# Altium schematic sheet GDRIVE4.SchDoc
size A3
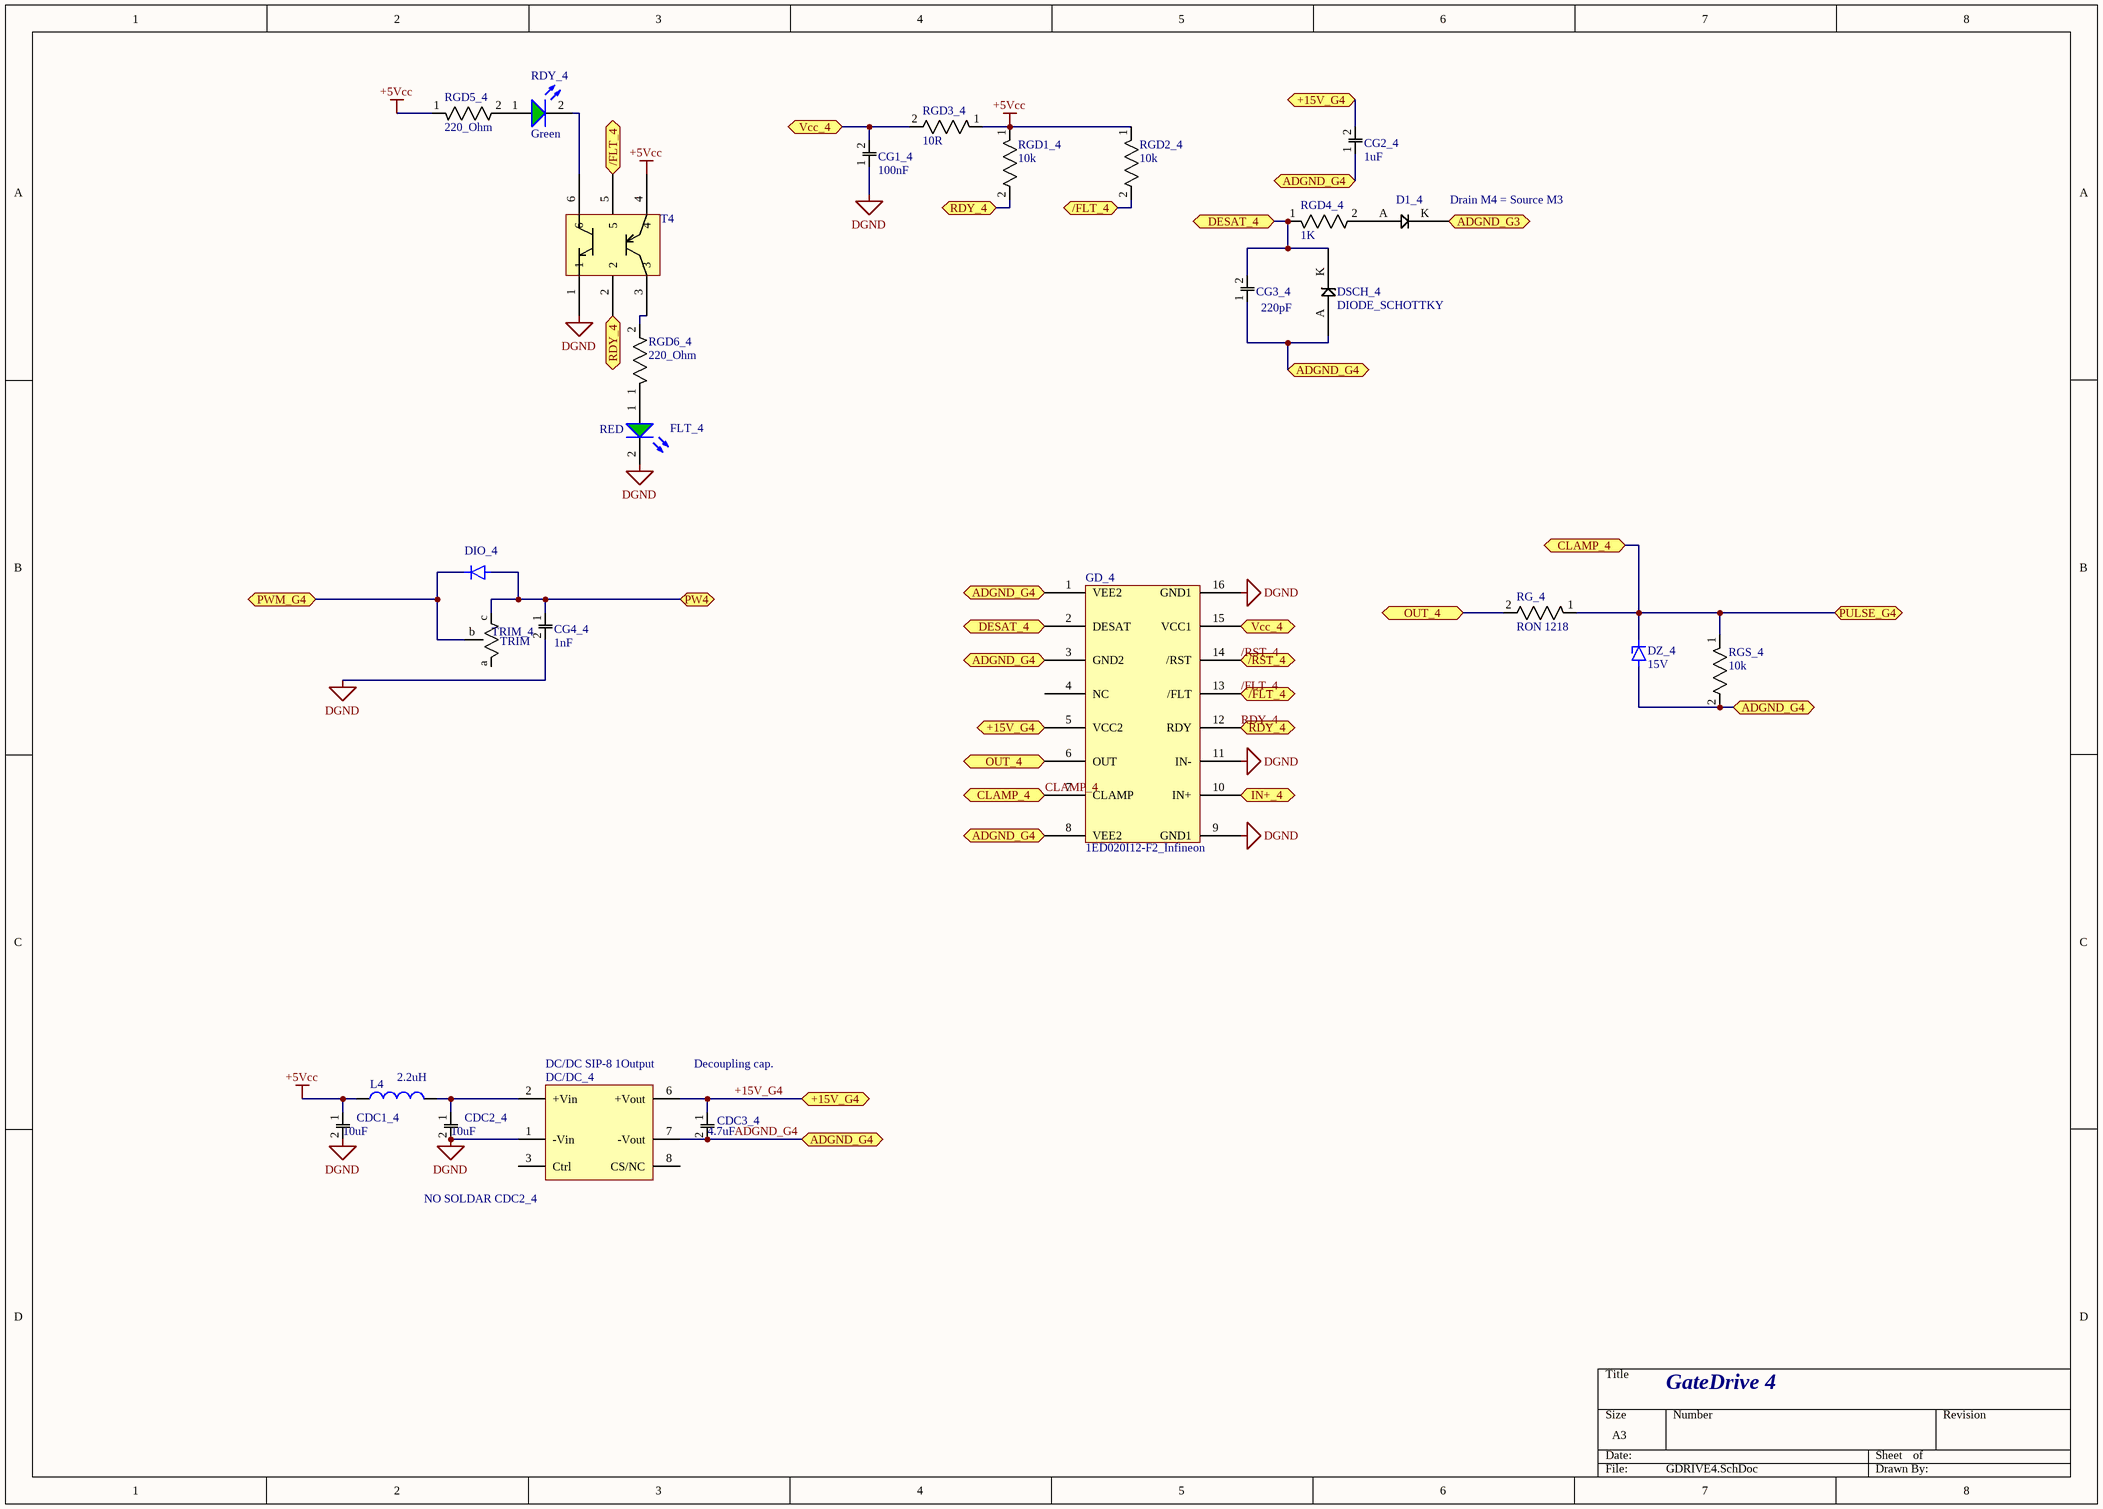
[diagram p0: GDRIVE4.SchDoc]

## Parts
CDC1_4  10uF  [C1206]
CDC2_4  10uF  [C1206]
CDC3_4  4.7uF  [C1206]
CG1_4  100nF  [CAP_0805_L]
CG2_4  1uF  [CAP_0603]
CG3_4  220pF  [CAP_0603]
CG4_4  1nF  [CAP_0805]
D1_4  DIODE  [DO-214AC]  (value not drawn)
DC/DC_4  DC/DC SIP-8 1Output  [DC/DC SIP-8]
DIO_4  DIOde  [DIO_BAS85-GS08]  (value not drawn)
DSCH_4  DIODE_SCHOTTKY  [SOD323W]
DZ_4  15V  [BZV55-C15,115]
FLT_4  RED  [LED_0805]
GD_4  1ED020I12-F2_Infineon  [SOIC_16W]
L4  2.2uH  [RES_0805]
RDY_4  Green  [LED_0805]
RG_4  RON 1218  [RES_1218]
RGD1_4  10k  [0603]
RGD2_4  10k  [0603]
RGD3_4  10R  [RES_1206]
RGD4_4  1K  [RES_0805]
RGD5_4  220_Ohm  [res_0805]
RGD6_4  220_Ohm  [res_0805]
RGS_4  10k  [RES_1206]
T4  TRANS PREBIAS  [SOT363_]  (value not drawn)
TRIM_4  TRIM  [TRIM_TS53YJ203MR10]

## Ports
+15V_G4 (bidir), /FLT_4 (bidir), /RST_4 (bidir), ADGND_G3 (bidir), ADGND_G4 (bidir), CLAMP_4 (bidir), DESAT_4 (bidir), IN+_4 (bidir), OUT_4 (bidir), PULSE_G4 (bidir), PW4 (bidir), PWM_G4 (bidir), RDY_4 (bidir), Vcc_4 (bidir)

## Nets
+5Vcc: CDC1_4.1 L4.1 RGD1_4.1(C) RGD2_4.1(C) RGD3_4.1(C) RGD5_4.1(C) T4.4
DGND: CDC1_4.2 CDC2_4.2 CG1_4.1 CG4_4.2 DC/DC_4.1(-Vin) FLT_4.2(C) GD_4.9(GND1) GD_4.11(IN-) GD_4.16(GND1) T4.1
+15V_G4: CDC3_4.1 CG2_4.2 DC/DC_4.6(+Vout) GD_4.5(VCC2) ; port +15V_G4
/FLT_4: GD_4.13(/FLT) RGD2_4.2(A) T4.5 ; port /FLT_4
/RST_4: GD_4.14(/RST) ; port /RST_4
ADGND_G3: D1_4.K ; port ADGND_G3
ADGND_G4: CDC3_4.2 CG2_4.1 CG3_4.1 DC/DC_4.7(-Vout) DSCH_4.A DZ_4.2(Anodo) GD_4.1(VEE2) GD_4.3(GND2) GD_4.8(VEE2) RGS_4.2(A) ; port ADGND_G4
CLAMP_4: DZ_4.1(Catodo) GD_4.7(CLAMP) RG_4.1(C) RGS_4.1(C) ; port CLAMP_4, port PULSE_G4
DESAT_4: CG3_4.2 DSCH_4.K GD_4.2(DESAT) RGD4_4.1(C) ; port DESAT_4
IN+_4: GD_4.10(IN+) ; port IN+_4
OUT_4: GD_4.6(OUT) RG_4.2(A) ; port OUT_4
PW4: CG4_4.1 DIO_4.2(Anodo) TRIM_4.c ; port PW4
PWM_G4: DIO_4.1(Catodo) TRIM_4.b ; port PWM_G4
RDY_4: GD_4.12(RDY) RGD1_4.2(A) T4.2 ; port RDY_4
Vcc_4: CG1_4.2 GD_4.15(VCC1) RGD3_4.2(A) ; port Vcc_4
NetCDC2_4_1: CDC2_4.1 DC/DC_4.2(+Vin) L4.2
NetD1_4_A: D1_4.A RGD4_4.2(A)
NetFLT_4_1: FLT_4.1(A) RGD6_4.1(C)
NetRDY_4_1: RDY_4.1(A) RGD5_4.2(A)
NetRDY_4_2: RDY_4.2(C) T4.6
NetRGD6_4_2: RGD6_4.2(A) T4.3

Not connected (* = marked no-connect by the designer): DC/DC_4 3(Ctrl) 8(CS/NC); GD_4 4(NC); TRIM_4 a

## Notes on the sheet
- (near D1_4) Drain M4 = Source M3
- Decoupling cap.
- (near DC/DC_4) NO SOLDAR CDC2_4
- GateDrive 4

## Library data of the parts
CDC1_4 CDC2_4 = CAP_C0805C105Z3VACTU: CAP CER 10UF 35V X6S 1206; Manufacturer Part Number: C3216X6S1V106K160AC; Digi-Key Part Number: 445-14778-1-ND; RS Part Number: 723-6647
CDC3_4 = CAP_C0805C105Z3VACTU: CAP CER 4.7UF 35V X7R 1206; Manufacturer Part Number: C3216X7R1V475K085AC; Digi-Key Part Number: 445-14805-1-ND; RS Part Number: *
CG1_4 = CAP_0603YC104KAT2A: CAP CER 0.1UF 50V X7R 0805; Manufacturer Part Number: 08055C104KAT2A; Digi-Key Part Number: 478-1395-1-ND; RS Part Number: *
CG2_4 = CAP_0603YC104KAT2A: CAP CER 1UF 50V X5R 0603; Manufacturer Part Number: CGA3E3X5R1H105K080AB; Digi-Key Part Number: 445-7878-1-ND; RS Part Number: *
CG3_4 = CAP_0603YC104KAT2A: CAP CER 220PF 50V C0G/NP0 0603; Manufacturer Part Number: C0603C221F5GACTU; Digi-Key Part Number: 399-7876-1-ND; RS Part Number: *
CG4_4 = CAP_C0805C102J5GACTU: CAP CER 1000PF 50V C0G/NP0 0805; Digi-Key Part Number: 399-1136-1-ND; Manufacturer Part Number: C0805C102J5GACTU; RS Part Number: *
D1_4 = DIODE: DIODE GEN PURP 1KV 1A SMA; Manufacturer Part Number: RS1MTR; Digi-Key Part Number: 1655-1501-1-ND; RS Part Number: *
DIO_4 = DIO_BAS85-GS08: DIODE SCHOTTKY 30V 200MA SOD80; Digi-Key Part Number: BAS85-GS08CT-ND; Manufacturer Part Number: BAS85-GS08; RS Part Number: *
DSCH_4 = DIODE_SCHOTTKY: DIODE SCHOTTKY 40V 750MA SOD323; Manufacturer Part Number: BAT165E6327HTSA1; Digi-Key Part Number: BAT165E6327HTSA1CT-ND; RS Part Number: *
DZ_4 = DIO_BZV55-C15,115: DIODE ZENER 15V 500MW SOD80C; Digi-Key Part Number: 1727-4962-1-ND; Manufacturer Part Number: BZV55-C15,115; RS Part Number: 484-3227
FLT_4 = WL-SMCW 0805  150080GS75000: Red 2V 0805; Manufacturer Part Number: 150080RS75000; Digi-Key Part Number: 732-4984-1-ND; RS Part Number: 815-4225
GD_4 = 1ED020I12-F2_Infineon: IC IGBT DVR 1200V 2A DSO16; Manufacturer Part Number: 1ED020I12F2XUMA1; Digi-Key Part Number: 1ED020I12F2XUMA1CT-ND; RS Part Number: 110-9111
L4 = Inductor: FIXED IND 2.2UH 600MA 160 MOHM; Manufacturer Part Number: MLZ2012M2R2HT000; Digi-key Part Number: 445-8658-1-ND; RS Part Number: *
RDY_4 = WL-SMCW 0805  150080GS75000: Red 2V 0805; Manufacturer Part Number: 150080VS75000; Digi-Key Part Number: 732-4986-1-ND
RG_4 = RES_RCL121847R0JNEK: Digi-Key Part Number: *; Manufacturer Part Number: *; RS Part Number: *
RGD1_4 RGD2_4 = RES_RCL121847R0JNEK: RES SMD 10K OHM 0.1% 3/8W 0603; Manufacturer Part Number: PHP00603E1002BST1; Digi-Key Part Number: 764-1103-6-ND; RS Part Number: 818-3052
RGD3_4 = RES_RCL121847R0JNEK: RES SMD 10 OHM 1W 1206 WIDE; Manufacturer Part Number: PRG3216P-10R0-D-T5; Digi-Key Part Number: 408-1809-1-ND; RS Part Number: *
RGD4_4 = RES_RCL121847R0JNEK: RES SMD 1K OHM 0.1% 1W 0805; Manufacturer Part Number: PCAN0805E1001BST5; Digi-Key Part Number: 764-1240-6-ND; RS Part Number: *
RGD5_4 RGD6_4 = RES_ERJ-3GEYJ471V: 1% 1/4W 0805; Manufacturer Part Number: RC0603FR-07220RL; Digi-Key Part Number: 311-220HRCT-ND; RS Part Number: *
RGS_4 = RES_ERJ-8ENF2002V: RES SMD 10K OHM 0-1% 1W 1206; Manufacturer Part Number: PHP01206E1002BST5; Digi-Key Part Number: PHP10.0KADKR_ND; RS Part Number: *
T4 = TRANS PREBIAS: TRANS PREBIAS NPN/PNP SOT666; Manufacturer Part Number: PUMD16,115; Digi-Key Part Number: 1727-3930-1-ND; RS Part Number: 518-3734
TRIM_4 = TRIM_TS53YJ203MR10: TRIMMER 1K OHM 0.25W SMD; Manufacturer Part Number: TS53YJ102MR10; Digi-Key Part Number: TS53YJ-1.0KCT-ND